# EAGLE design Swerve Hall Effect Sensor Board (EAGLE 7.1.0)
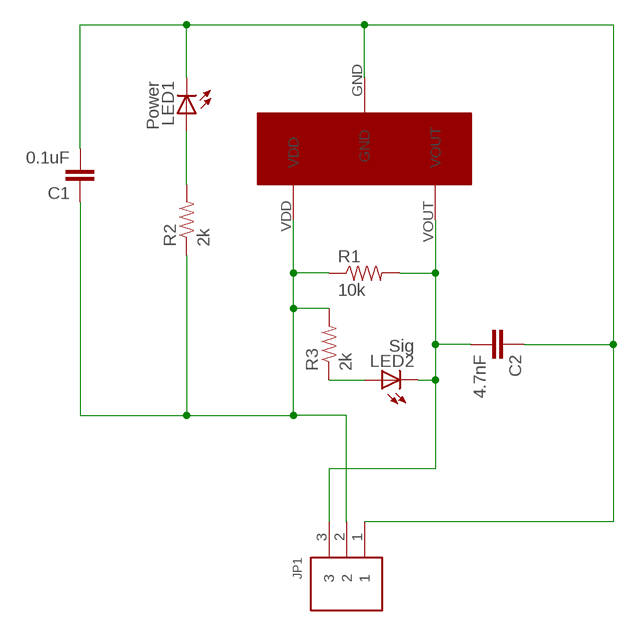
[diagram p0: schematic, sheet 1]

## Parts
C1  0.1uF  CAP0603-CAP  [0603-CAP]
C2  4.7nF  CAP0603-CAP  [0603-CAP]
JP1  3PIN  [B3B-PH-K-S]
LED1  Power  LED0603  [LED-0603]
LED2  Sig  LED0603  [LED-0603]
R1  10k  RESISTOR0603-RES  [0603-RES]
R2  2k  RESISTOR0603-RES  [0603-RES]
R3  2k  RESISTOR0603-RES  [0603-RES]
U$1  US5881-HALL-EFFECT  [US5881-HALL-EFFECT]

## Nets
GND: C1.2 C2.1 JP1.1 LED1.C U$1.GND
N$6: LED1.A R2.2
N$7: LED2.A R3.1
SIGNAL: C2.2 JP1.3 LED2.C R1.2 U$1.VOUT
VDD: C1.1 JP1.2 R1.1 R2.1 R3.2 U$1.VDD

## Library data of the parts
C1 C2 = SparkFun-Passives:CAP: Capacitor Standard 0603 ceramic capacitor, and 0.1" leaded capacitor.
JP1 = jst_eph:3PIN
LED1 LED2 = SparkFun-LED:LED: LEDs Standard schematic elements and footprints for 5mm, 3mm, 1206, and 0603 sized LEDs. 5mm - Spark Fun Electronics SKU : COM-00529 (and others)
R1-R3 = SparkFun-Passives:RESISTOR: Resistor Basic schematic elements and footprints for 0603, 1206, and PTH resistors.
U$1 = TPS5430:US5881-HALL-EFFECT

## Board
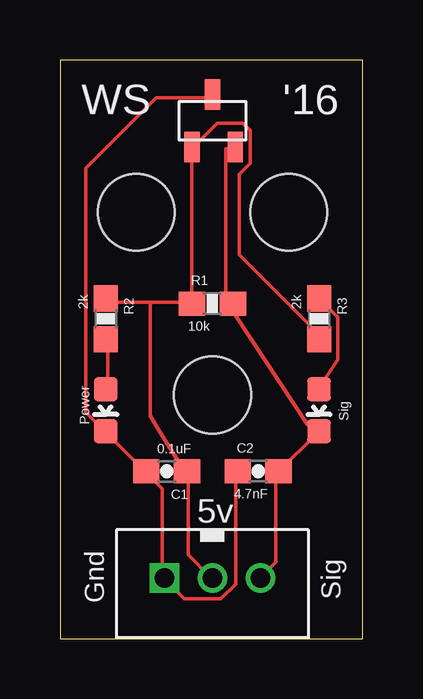
[diagram p1: board, top side]

Size 12.62 x 24.12 mm. Coordinates in mm from the lower left corner, seen from the top.
Outline: 0,0 12.62,0 12.62,24.12 0,24.12 0,0
Copper layers (1*16): Top 0.0356mm / dielectric 1.5011mm / Bottom 0.0356mm
Design rules "LaenPCBOrder": minimum track width 6mil, minimum drill 13mil, track to track 6mil, track to pad 6mil, pad to pad 6mil, via to via 6mil, smd to smd 6mil, copper to edge 15mil, drill to drill 6mil, minimum pad ring 7mil, minimum via ring 7mil, stop-mask expansion 3mil, vias tented up to drill 0mil, thermal gap 10mil
Holes 3.2 mm at 3.17,17.78 9.53,17.78 6.35,10.16

### Footprints (pad centres in the part's own frame; a part is rotated, then mirrored left to right if it is on the bottom)
0603-CAP = smd 1.1 x 1: 1 -0.85,0; 2 0.85,0
B3B-PH-K-S = drill 0.813 square: 1 2,0 | drill 0.813: 2 0,0; 3 -2,0
LED-0603 = smd 1 x 1: A 0,-0.877; C 0,0.877
0603-RES = smd 1.1 x 1: 1 -0.85,0; 2 0.85,0
US5881-HALL-EFFECT = smd 0.635 x 1.27: GND 0,1.1; VDD -0.85,-1.1; VOUT 0.95,-1.1

### Placement (x,y rotation side)
C1  4.45,6.99 180 top
C2  8.26,6.99 0 top
JP1  6.35,2.54 180 top
LED1  1.91,9.53 180 top
LED2  10.79,9.53 180 top
R1  6.35,13.97 0 top
R2  1.91,13.34 270 top
R3  10.79,13.34 270 top
U$1  6.35,21.59 0 top

### Tracks (layer width: path | path; a pad name or v marks a point on that pad's centre or on a via)
GND
  Top 0.152: C2.1 7.32,6.86 7.32,2.29 6.71,1.68 5.18,1.68 4.42,2.44 JP1.1 4.27,2.59 4.27,6.25 3.66,6.86 C1.2 3.5,7.01 1.98,8.53 LED1.C 1.83,8.69 1.07,9.45 1.07,19.61 4.01,22.55 6.25,22.55 U$1.GND
N$6
  Top 0.152: LED1.A 1.98,10.52 1.98,12.34 R2.2
N$7
  Top 0.152: LED2.A 10.82,10.52 11.07,10.87 11.58,11.63 11.58,13.41 10.82,14.17 R3.1
SIGNAL
  Top 0.152: U$1.VOUT 6.91,20.42 6.91,14.02 R1.2 7.32,13.87 7.32,13.46 10.31,8.94 LED2.C 10.67,8.53 9.14,7.01 C2.2 8.99,6.86 8.99,3.2 8.38,2.59 JP1.3
VDD
  Top 0.152: JP1.2 6.25,2.59 5.33,3.5 5.33,6.86 C1.1 5.18,7.01 4.17,8.64 3.76,9.3 3.76,14.02 | 3.76,14.02 2.13,14.02 1.98,14.17 R2.1 | 3.76,14.02 5.49,14.02 | R3.2 10.67,12.5 10.67,12.8 7.47,16 7.47,19.36 7.92,19.81 7.92,21.18 7.62,21.49 6.55,21.49 5.64,20.57 U$1.VDD 5.49,20.42 5.49,14.02 | 5.49,14.02 R1.1

### Text on the board
tPlace: WS | '16 | 5v | Gnd | Sig